# Altium schematic sheet Coincidence.SchDoc
size A4
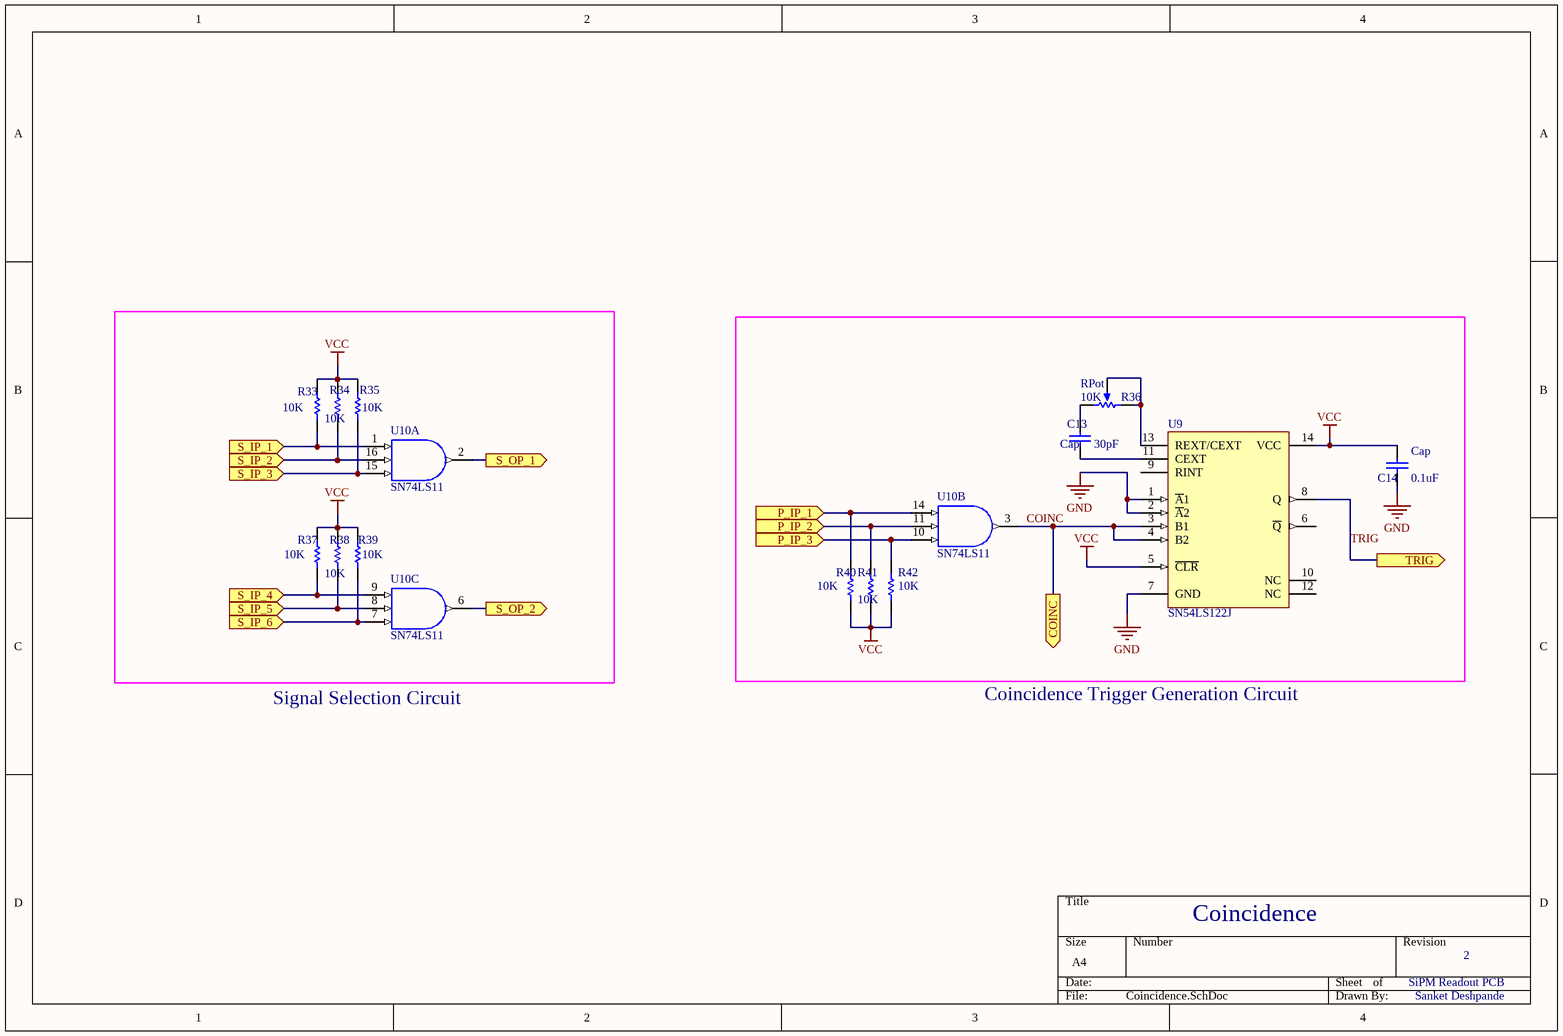
[diagram p0: Coincidence.SchDoc]

## Parts
C13  Cap  value 30pF  [RAD-0.3]
C14  Cap  value 0.1uF  [RAD-0.3]
R33  value 10K  [AXIAL-0.3]  (hidden comment: Res1)
R34  value 10K  [AXIAL-0.3]  (hidden comment: Res1)
R35  value 10K  [AXIAL-0.3]  (hidden comment: Res1)
R36  RPot  value 10K  [VR5]
R37  value 10K  [AXIAL-0.3]  (hidden comment: Res1)
R38  value 10K  [AXIAL-0.3]  (hidden comment: Res1)
R39  value 10K  [AXIAL-0.3]  (hidden comment: Res1)
R40  value 10K  [AXIAL-0.3]  (hidden comment: Res1)
R41  value 10K  [AXIAL-0.3]  (hidden comment: Res1)
R42  value 10K  [AXIAL-0.3]  (hidden comment: Res1)
U9  SN54LS122J  [J014]
U10  SN74LS11  [J016]  (parts A,B,C of 3)

## Ports
COINC (out), P_IP_1 (in), P_IP_2 (in), P_IP_3 (in), S_IP_1 (in), S_IP_2 (in), S_IP_3 (in), S_IP_4 (in), S_IP_5 (in), S_IP_6 (in), S_OP_1 (out), S_OP_2 (out), TRIG (out)

## Nets
GND: C14.1 U9.1(~{A}1) U9.2(~{A}2) U9.7(GND) U10.4(GND) U10.5(GND)
VCC: C14.2 R33.1 R34.1 R35.1 R37.1 R38.1 R39.1 R40.1 R41.1 R42.1 U9.5(~{CLR}) U9.14(VCC) U10.12(VCC) U10.13(VCC)
COINC: U9.3(B1) U9.4(B2) U10.3(Y) ; port COINC
P_IP_1: R40.2 U10.14(A) ; port P_IP_1
P_IP_2: R41.2 U10.11(B) ; port P_IP_2
P_IP_3: R42.2 U10.10(C) ; port P_IP_3
S_IP_1: R33.2 U10.1(A) ; port S_IP_1
S_IP_2: R34.2 U10.16(B) ; port S_IP_2
S_IP_3: R35.2 U10.15(C) ; port S_IP_3
S_IP_4: R37.2 U10.9(A) ; port S_IP_4
S_IP_5: R38.2 U10.8(B) ; port S_IP_5
S_IP_6: R39.2 U10.7(C) ; port S_IP_6
S_OP_1: U10.2(Y) ; port S_OP_1
S_OP_2: U10.6(Y) ; port S_OP_2
TRIG: U9.8(Q) ; port TRIG
NetC13_1: C13.1 U9.11(CEXT)
NetC13_2: C13.2 R36.2(BOT)
NetR36_1: R36.1(TOP) R36.3(TAP) U9.13(REXT/CEXT)

Not connected (* = marked no-connect by the designer): U9 6(~{Q}) 9(RINT) 10(NC) 12(NC)

## Notes on the sheet
- Signal Selection Circuit
- Coincidence Trigger Generation Circuit
- Coincidence
- SiPM Readout PCB
- 2
- Sanket Deshpande

## Library data of the parts
C13 C14 = Cap: Capacitor; Published: 8-Jun-2000; LatestRevisionDate: 17-Jul-2002; LatestRevisionNote: Re-released for DXP Platform.; PackageReference: RAD-0.3; Publisher: Altium Limited; PackageDescription: Radial Cap, Thru-Hole; 2 Leads; 0.3 in Pin Spacing
R33-R35 R37-R42 = Res1: Resistor; Published: 8-Jun-2000; LatestRevisionDate: 17-Jul-2002; LatestRevisionNote: Re-released for DXP Platform.; PackageReference: AXIAL-0.3; Publisher: Altium Limited; PackageDescription: Axial Device, Thru-Hole; 2 Leads; 0.3 in Pin Spacing
R36 = RPot: Potentiometer; Sim Note: Enter the Resistance value and the set point into parameter fields.; Set Position: 0.5; Published: 8-Jun-2000; LatestRevisionDate: 17-Jul-2002; LatestRevisionNote: Re-released for DXP Platform.; PackageReference: VR5; Publisher: Altium Limited; PackageDescription: Variable Resistor, Thru-Hole; 3 Leads
U9 = SN54LS122J: Retriggerable Monostable Multivibrator; Note: Pins No 10 and 12 are not connected and not drawn; Published: 8-Jun-2000; LatestRevisionDate: 04-Mar-2005; LatestRevisionNote: Stylized 3D Model Added.; DatasheetVersion: Mar-1988; PackageVersion: Jun-1999; PackageReference: J014; Publisher: Altium Limited; PackageDescription: DIP; 14 Leads; Row Spacing 7.62 mm; Pitch 2.54 mm; ComponentLink1Description: Manufacturer Link; ComponentLink1URL: http://www.ti.com/; ComponentLink2Description: Datasheet; ComponentLink2URL: http://www-s.ti.com/sc/ds/sn54ls123.pdf
U10 = 54AC11011J: Triple 3-Input Positive-AND Gate; Published: 8-Jun-2000; LatestRevisionDate: 04-Mar-2005; LatestRevisionNote: Stylized 3D Model Added.; DatasheetVersion: Apr-1993; PackageVersion: Jun-1999; PackageReference: J016; Publisher: Altium Limited; PackageDescription: DIP; 16 Leads; Row Spacing 7.62 mm; Pitch 2.54 mm; ComponentLink1Description: Manufacturer Link; ComponentLink1URL: http://www.ti.com/; ComponentLink2Description: Datasheet; ComponentLink2URL: http://www-s.ti.com/sc/ds/74ac11011.pdf; ComponentLink3Description: Packaging Specification; ComponentLink3URL: http://focus.ti.com/lit/ml/mcer002d/mcer002d.pdf